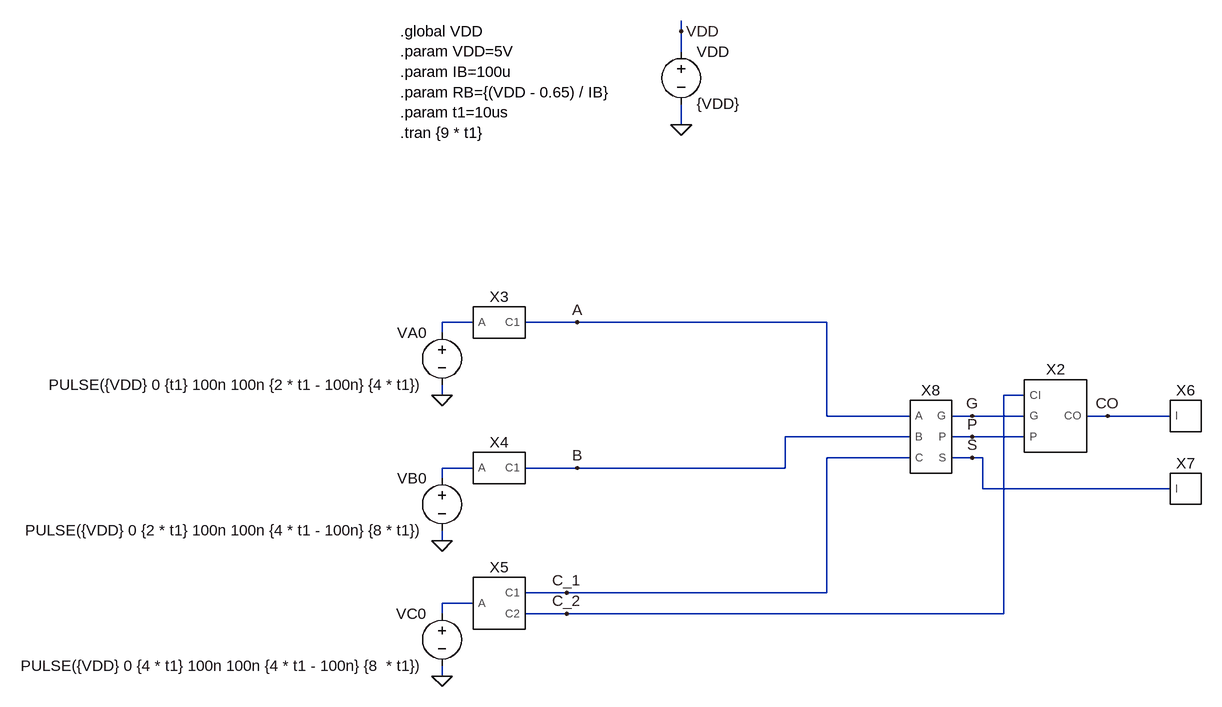
[diagram p0: schematic tb_add1.asc]
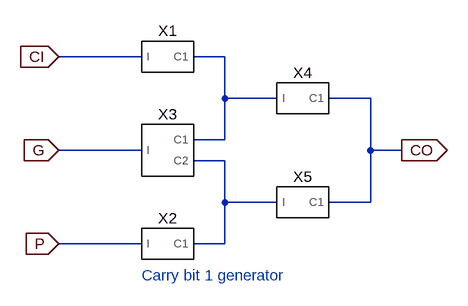
[diagram p1: sub-circuit cla1.asc]
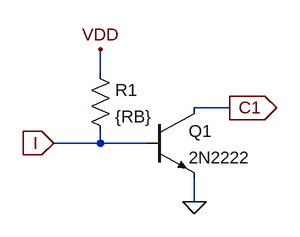
[diagram p2: sub-circuit iilg1.asc]
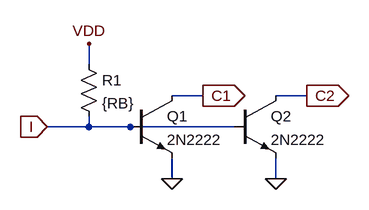
[diagram p3: sub-circuit iilg2.asc]
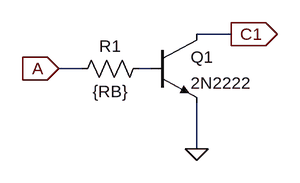
[diagram p4: sub-circuit iilin1.asc]
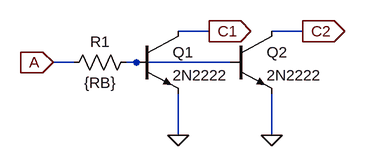
[diagram p5: sub-circuit iilin2.asc]
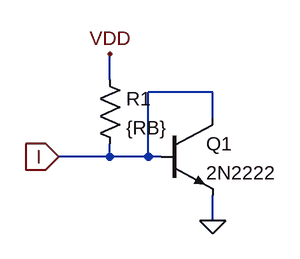
[diagram p6: sub-circuit iilout.asc]
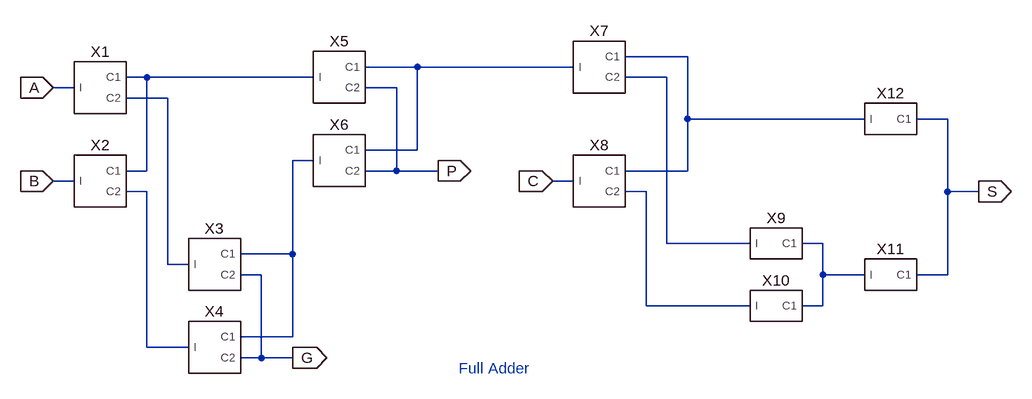
[diagram p7: sub-circuit fag1p1.asc]
tb_add1.asc, the LTspice schematic file:
Version 4
SHEET 1 4164 944
WIRE -16 -752 -16 -768
WIRE -16 -720 -16 -752
WIRE -16 -608 -16 -640
WIRE -336 -304 -384 -304
WIRE -176 -304 -256 -304
WIRE 208 -304 -176 -304
WIRE -384 -288 -384 -304
WIRE -384 -192 -384 -208
WIRE 512 -192 480 -192
WIRE 208 -160 208 -304
WIRE 336 -160 208 -160
WIRE 432 -160 400 -160
WIRE 512 -160 432 -160
WIRE 640 -160 608 -160
WIRE 736 -160 640 -160
WIRE 336 -128 144 -128
WIRE 432 -128 400 -128
WIRE 512 -128 432 -128
WIRE 336 -96 208 -96
WIRE 432 -96 400 -96
WIRE 448 -96 432 -96
WIRE -336 -80 -384 -80
WIRE -176 -80 -256 -80
WIRE 144 -80 144 -128
WIRE 144 -80 -176 -80
WIRE -384 -64 -384 -80
WIRE 448 -48 448 -96
WIRE 736 -48 448 -48
WIRE -384 32 -384 16
WIRE -192 112 -256 112
WIRE 208 112 208 -96
WIRE 208 112 -192 112
WIRE -336 128 -384 128
WIRE -384 144 -384 128
WIRE -192 144 -256 144
WIRE 480 144 480 -192
WIRE 480 144 -192 144
WIRE -384 240 -384 224
FLAG -16 -608 0
FLAG -16 -752 VDD
FLAG -384 -192 0
FLAG -384 32 0
FLAG -384 240 0
FLAG -176 -304 A
FLAG -176 -80 B
FLAG 432 -160 G
FLAG 432 -128 P
FLAG 432 -96 S
FLAG 640 -160 CO
FLAG -192 112 C_1
FLAG -192 144 C_2
SYMBOL voltage -16 -736 R0
SYMATTR InstName VDD
SYMATTR Value {VDD}
SYMBOL voltage -384 -304 M0
SYMATTR InstName VA0
SYMATTR Value PULSE({VDD} 0 {t1} 100n 100n {2 * t1 - 100n} {4 * t1})
SYMBOL voltage -384 -80 M0
SYMATTR InstName VB0
SYMATTR Value PULSE({VDD} 0 {2 * t1} 100n 100n {4 * t1 - 100n} {8 * t1})
SYMBOL voltage -384 128 M0
SYMATTR InstName VC0
SYMATTR Value PULSE({VDD} 0 {4 * t1} 100n 100n {4 * t1 - 100n} {8  * t1})
SYMBOL cla1 560 -160 R0
SYMATTR InstName X2
SYMBOL iilin1 -304 -304 R0
SYMATTR InstName X3
SYMBOL iilin1 -304 -80 R0
SYMATTR InstName X4
SYMBOL iilin2 -304 128 R0
SYMATTR InstName X5
SYMBOL iilout 752 -160 R0
SYMATTR InstName X6
SYMBOL iilout 752 -48 R0
SYMATTR InstName X7
SYMBOL fag1p1 368 -128 R0
SYMATTR InstName X8
TEXT -448 -752 Left 2 !.global VDD\n.param VDD=5V\n.param IB=100u\n.param RB={(VDD - 0.65) / IB}\n.param t1=10us\n.tran {9 * t1}

cla1.asc, the sub-circuit schematic file:
Version 4
SHEET 1 1856 1728
WIRE 336 192 208 192
WIRE 464 192 416 192
WIRE 464 256 464 192
WIRE 544 256 464 256
WIRE 688 256 624 256
WIRE 464 320 464 256
WIRE 464 320 416 320
WIRE 336 336 208 336
WIRE 688 336 688 256
WIRE 736 336 688 336
WIRE 464 352 416 352
WIRE 464 416 464 352
WIRE 544 416 464 416
WIRE 688 416 688 336
WIRE 688 416 624 416
WIRE 336 480 208 480
WIRE 464 480 464 416
WIRE 464 480 416 480
FLAG 208 192 CI
IOPIN 208 192 In
FLAG 208 336 G
IOPIN 208 336 In
FLAG 208 480 P
IOPIN 208 480 In
FLAG 736 336 CO
IOPIN 736 336 Out
SYMBOL iilg1 368 192 R0
SYMATTR InstName X1
SYMBOL iilg1 368 480 R0
SYMATTR InstName X2
SYMBOL iilg2 368 336 R0
SYMATTR InstName X3
SYMBOL iilg1 576 256 R0
SYMATTR InstName X4
SYMBOL iilg1 576 416 R0
SYMATTR InstName X5
TEXT 336 528 Left 2 ;Carry bit 1 generator

iilg1.asc, the sub-circuit schematic file:
Version 4
SHEET 1 880 680
WIRE 384 240 384 208
WIRE 560 288 512 288
WIRE 384 336 384 320
WIRE 384 336 320 336
WIRE 448 336 384 336
WIRE 512 416 512 384
FLAG 512 416 0
FLAG 384 208 VDD
FLAG 320 336 I
IOPIN 320 336 In
FLAG 560 288 C1
IOPIN 560 288 Out
SYMBOL npn 448 288 R0
SYMATTR InstName Q1
SYMATTR Value 2N2222
SYMBOL res 368 224 R0
SYMATTR InstName R1
SYMATTR Value {RB}

iilg2.asc, the sub-circuit schematic file:
Version 4
SHEET 1 880 680
WIRE 384 240 384 208
WIRE 560 288 512 288
WIRE 720 288 672 288
WIRE 384 336 384 320
WIRE 384 336 320 336
WIRE 448 336 384 336
WIRE 608 336 448 336
WIRE 512 416 512 384
WIRE 672 416 672 384
FLAG 384 208 VDD
FLAG 320 336 I
IOPIN 320 336 In
FLAG 512 416 0
FLAG 560 288 C1
IOPIN 560 288 Out
FLAG 672 416 0
FLAG 720 288 C2
IOPIN 720 288 Out
SYMBOL npn 448 288 R0
SYMATTR InstName Q1
SYMATTR Value 2N2222
SYMBOL res 368 224 R0
SYMATTR InstName R1
SYMATTR Value {RB}
SYMBOL npn 608 288 R0
SYMATTR InstName Q2
SYMATTR Value 2N2222

iilin1.asc, the sub-circuit schematic file:
Version 4
SHEET 1 880 680
WIRE 240 192 192 192
WIRE 32 240 0 240
WIRE 128 240 112 240
WIRE 192 352 192 288
FLAG 192 352 0
FLAG 240 192 C1
IOPIN 240 192 Out
FLAG 0 240 A
IOPIN 0 240 In
SYMBOL npn 128 192 R0
SYMATTR InstName Q1
SYMATTR Value 2N2222
SYMBOL res 16 256 R270
WINDOW 0 32 56 VTop 2
WINDOW 3 0 56 VBottom 2
SYMATTR InstName R1
SYMATTR Value {RB}

iilin2.asc, the sub-circuit schematic file:
Version 4
SHEET 1 880 680
WIRE 240 192 192 192
WIRE 384 192 336 192
WIRE 32 240 0 240
WIRE 128 240 112 240
WIRE 272 240 128 240
WIRE 192 352 192 288
WIRE 336 352 336 288
FLAG 192 352 0
FLAG 240 192 C1
IOPIN 240 192 Out
FLAG 0 240 A
IOPIN 0 240 In
FLAG 336 352 0
FLAG 384 192 C2
IOPIN 384 192 Out
SYMBOL npn 128 192 R0
SYMATTR InstName Q1
SYMATTR Value 2N2222
SYMBOL res 16 256 R270
WINDOW 0 32 56 VTop 2
WINDOW 3 0 56 VBottom 2
SYMATTR InstName R1
SYMATTR Value {RB}
SYMBOL npn 272 192 R0
SYMATTR InstName Q2
SYMATTR Value 2N2222

iilout.asc, the sub-circuit schematic file:
Version 4
SHEET 1 880 680
WIRE 48 208 48 176
WIRE 176 224 96 224
WIRE 176 256 176 224
WIRE 48 304 48 288
WIRE 48 304 -16 304
WIRE 96 304 96 224
WIRE 96 304 48 304
WIRE 112 304 96 304
WIRE 176 384 176 352
FLAG 176 384 0
FLAG 48 176 VDD
FLAG -16 304 I
IOPIN -16 304 In
SYMBOL npn 112 256 R0
SYMATTR InstName Q1
SYMATTR Value 2N2222
SYMBOL res 32 192 R0
SYMATTR InstName R1
SYMATTR Value {RB}

fag1p1.asc, the sub-circuit schematic file:
Version 4
SHEET 1 4164 944
WIRE 1264 -288 1168 -288
WIRE 848 -272 768 -272
WIRE 1088 -272 848 -272
WIRE 432 -256 400 -256
WIRE 688 -256 432 -256
WIRE 1232 -256 1168 -256
WIRE 320 -240 288 -240
WIRE 816 -240 768 -240
WIRE 464 -224 400 -224
WIRE 1264 -192 1264 -288
WIRE 1536 -192 1264 -192
WIRE 1664 -192 1616 -192
WIRE 848 -144 848 -272
WIRE 848 -144 768 -144
WIRE 688 -128 656 -128
WIRE 432 -112 432 -256
WIRE 432 -112 400 -112
WIRE 816 -112 816 -240
WIRE 816 -112 768 -112
WIRE 880 -112 816 -112
WIRE 1264 -112 1264 -192
WIRE 1264 -112 1168 -112
WIRE 320 -96 288 -96
WIRE 1088 -96 1056 -96
WIRE 432 -80 400 -80
WIRE 1200 -80 1168 -80
WIRE 1664 -80 1664 -192
WIRE 1712 -80 1664 -80
WIRE 1232 0 1232 -256
WIRE 1360 0 1232 0
WIRE 1472 0 1440 0
WIRE 656 16 656 -128
WIRE 656 16 576 16
WIRE 464 32 464 -224
WIRE 496 32 464 32
WIRE 608 48 576 48
WIRE 1472 48 1472 0
WIRE 1536 48 1472 48
WIRE 1664 48 1664 -80
WIRE 1664 48 1616 48
WIRE 1200 96 1200 -80
WIRE 1360 96 1200 96
WIRE 1472 96 1472 48
WIRE 1472 96 1440 96
WIRE 656 144 656 16
WIRE 656 144 576 144
WIRE 432 160 432 -80
WIRE 496 160 432 160
WIRE 608 176 608 48
WIRE 608 176 576 176
WIRE 656 176 608 176
FLAG 288 -240 A
IOPIN 288 -240 In
FLAG 288 -96 B
IOPIN 288 -96 In
FLAG 1056 -96 C
IOPIN 1056 -96 In
FLAG 656 176 G
IOPIN 656 176 Out
FLAG 880 -112 P
IOPIN 880 -112 Out
FLAG 1712 -80 S
IOPIN 1712 -80 Out
SYMBOL iilg2 352 -240 R0
SYMATTR InstName X1
SYMBOL iilg2 352 -96 R0
SYMATTR InstName X2
SYMBOL iilg2 528 32 R0
SYMATTR InstName X3
SYMBOL iilg2 528 160 R0
SYMATTR InstName X4
SYMBOL iilg2 720 -256 R0
SYMATTR InstName X5
SYMBOL iilg2 720 -128 R0
SYMATTR InstName X6
SYMBOL iilg2 1120 -272 R0
SYMATTR InstName X7
SYMBOL iilg1 1392 0 R0
SYMATTR InstName X9
SYMBOL iilg1 1392 96 R0
SYMATTR InstName X10
SYMBOL iilg1 1568 48 R0
SYMATTR InstName X11
SYMBOL iilg1 1568 -192 R0
SYMATTR InstName X12
SYMBOL iilg2 1120 -96 R0
SYMATTR InstName X8
TEXT 912 192 Left 2 ;Full Adder

The netlist it stands for:
* tb_add1.asc
VDD VDD 0 {VDD}
VA0 N001 0 PULSE({VDD} 0 {t1} 100n 100n {2 * t1 - 100n} {4 * t1})
VB0 N002 0 PULSE({VDD} 0 {2 * t1} 100n 100n {4 * t1 - 100n} {8 * t1})
VC0 N003 0 PULSE({VDD} 0 {4 * t1} 100n 100n {4 * t1 - 100n} {8  * t1})
XX2 C_2 G P CO cla1
XX3 N001 A iilin1
XX4 N002 B iilin1
XX5 N003 C_1 C_2 iilin2
XX6 CO iilout
XX7 S iilout
XX8 A B C_1 G P S fag1p1

* block symbol definitions
.subckt cla1 CI G P CO
XX1 CI N001 iilg1
XX2 P N002 iilg1
XX3 G N001 N002 iilg2
XX4 N001 CO iilg1
XX5 N002 CO iilg1
* Carry bit 1 generator
.ends cla1

.subckt iilg1 I C1
Q1 C1 I 0 0 2N2222
R1 VDD I {RB}
.ends iilg1

.subckt iilg2 I C1 C2
Q1 C1 I 0 0 2N2222
R1 VDD I {RB}
Q2 C2 I 0 0 2N2222
.ends iilg2

.subckt iilin1 A C1
Q1 C1 N001 0 0 2N2222
R1 A N001 {RB}
.ends iilin1

.subckt iilin2 A C1 C2
Q1 C1 N001 0 0 2N2222
R1 A N001 {RB}
Q2 C2 N001 0 0 2N2222
.ends iilin2

.subckt iilout I
Q1 I I 0 0 2N2222
R1 VDD I {RB}
.ends iilout

.subckt fag1p1 A B C G P S
XX1 A N003 N005 iilg2
XX2 B N003 N007 iilg2
XX3 N005 N006 G iilg2
XX4 N007 N006 G iilg2
XX5 N003 N002 P iilg2
XX6 N006 N002 P iilg2
XX7 N002 N001 N004 iilg2
XX9 N004 N009 iilg1
XX10 N008 N009 iilg1
XX11 N009 S iilg1
XX12 N001 S iilg1
XX8 C N001 N008 iilg2
* Full Adder
.ends fag1p1

.model NPN NPN
.model PNP PNP
.lib standard.bjt
.global VDD
.param VDD=5V
.param IB=100u
.param RB={(VDD - 0.65) / IB}
.param t1=10us
.tran {9 * t1}
.backanno
.end